# Altium schematic sheet LEDsAndButtons.SchDoc
size A
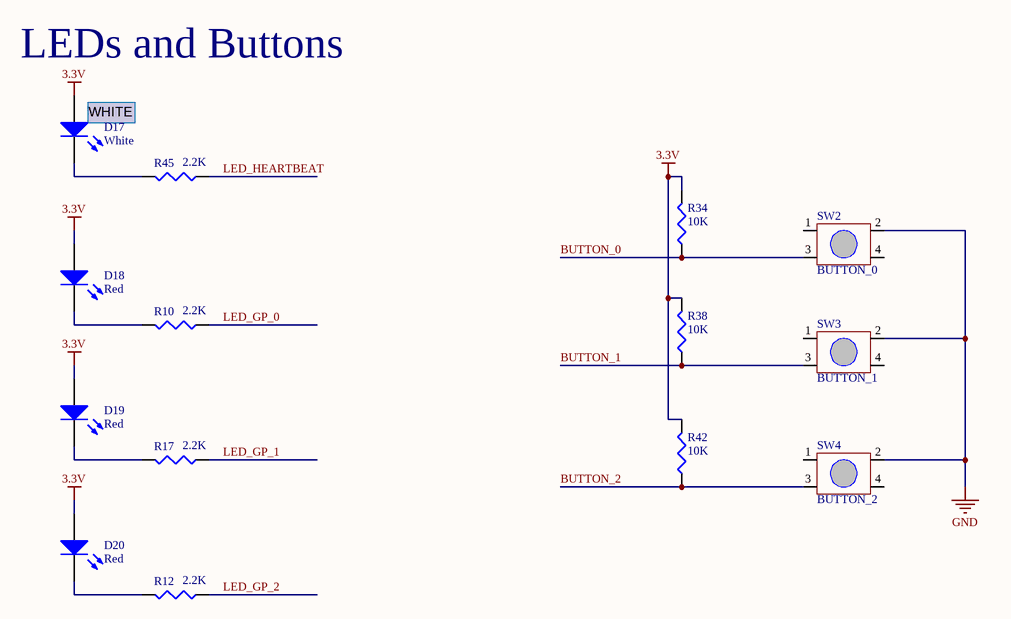
[diagram p0: LEDsAndButtons.SchDoc]

## Parts
D17  White  [SurfaceMount(603)]
D18  Red  [SurfaceMount(603)]
D19  Red  [SurfaceMount(603)]
D20  Red  [SurfaceMount(603)]
R10  value 2.2K  [RESC1608L]  (hidden comment: Res3)
R12  value 2.2K  [RESC1608L]  (hidden comment: Res3)
R17  value 2.2K  [RESC1608L]  (hidden comment: Res3)
R34  value 10K  [RESC1608L]  (hidden comment: Res3)
R38  value 10K  [RESC1608L]  (hidden comment: Res3)
R42  value 10K  [RESC1608L]  (hidden comment: Res3)
R45  value 2.2K  [RESC1608L]  (hidden comment: Res3)
SW2  BUTTON_0  [SwitchTall-TL330]
SW3  BUTTON_1  [SwitchTall-TL330]
SW4  BUTTON_2  [SwitchTall-TL330]

## Nets
3.3V: D17.1(A) D18.1(A) D19.1(A) D20.1(A) R34.2 R38.2 R42.2
GND: SW2.2 SW3.2 SW4.2
BUTTON_0: R34.1 SW2.3
BUTTON_1: R38.1 SW3.3
BUTTON_2: R42.1 SW4.3
LED_GP_0: R10.1
LED_GP_1: R17.1
LED_GP_2: R12.1
LED_HEARTBEAT: R45.1
NetD17_2: D17.2(K) R45.2
NetD18_2: D18.2(K) R10.2
NetD19_2: D19.2(K) R17.2
NetD20_2: D20.2(K) R12.2

Not connected (* = marked no-connect by the designer): SW2 1 4; SW3 1 4; SW4 1 4

## Notes on the sheet
- LEDs and Buttons
- (near D17) WHITE

## Library data of the parts
D17-D20 = LED
R10 R12 R17 R34 R38 R42 R45 = Res3: Resistor; Published: 8-Jun-2000; LatestRevisionDate: 29-May-2009; LatestRevisionNote: IPC-7351 Footprint Added.; PackageReference: J1-0603; Publisher: Altium Limited; PackageDescription: Chip Resistor
SW2-SW4 = Switch-TL330